# EAGLE schematic alan2 (EAGLE 7.4.0)
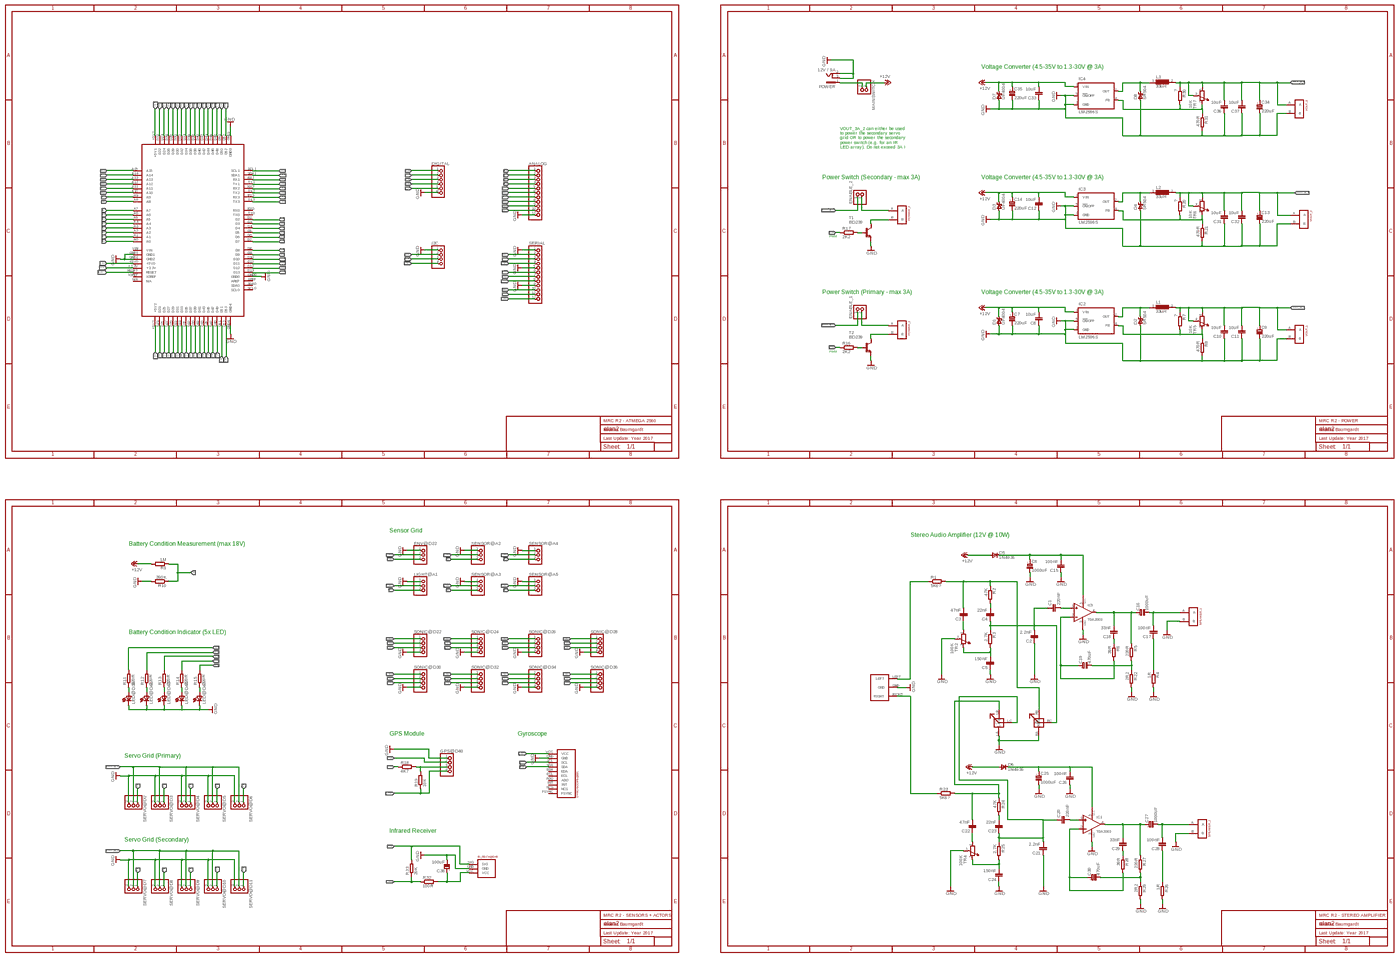
[diagram p0: schematic, sheet 1, overview]
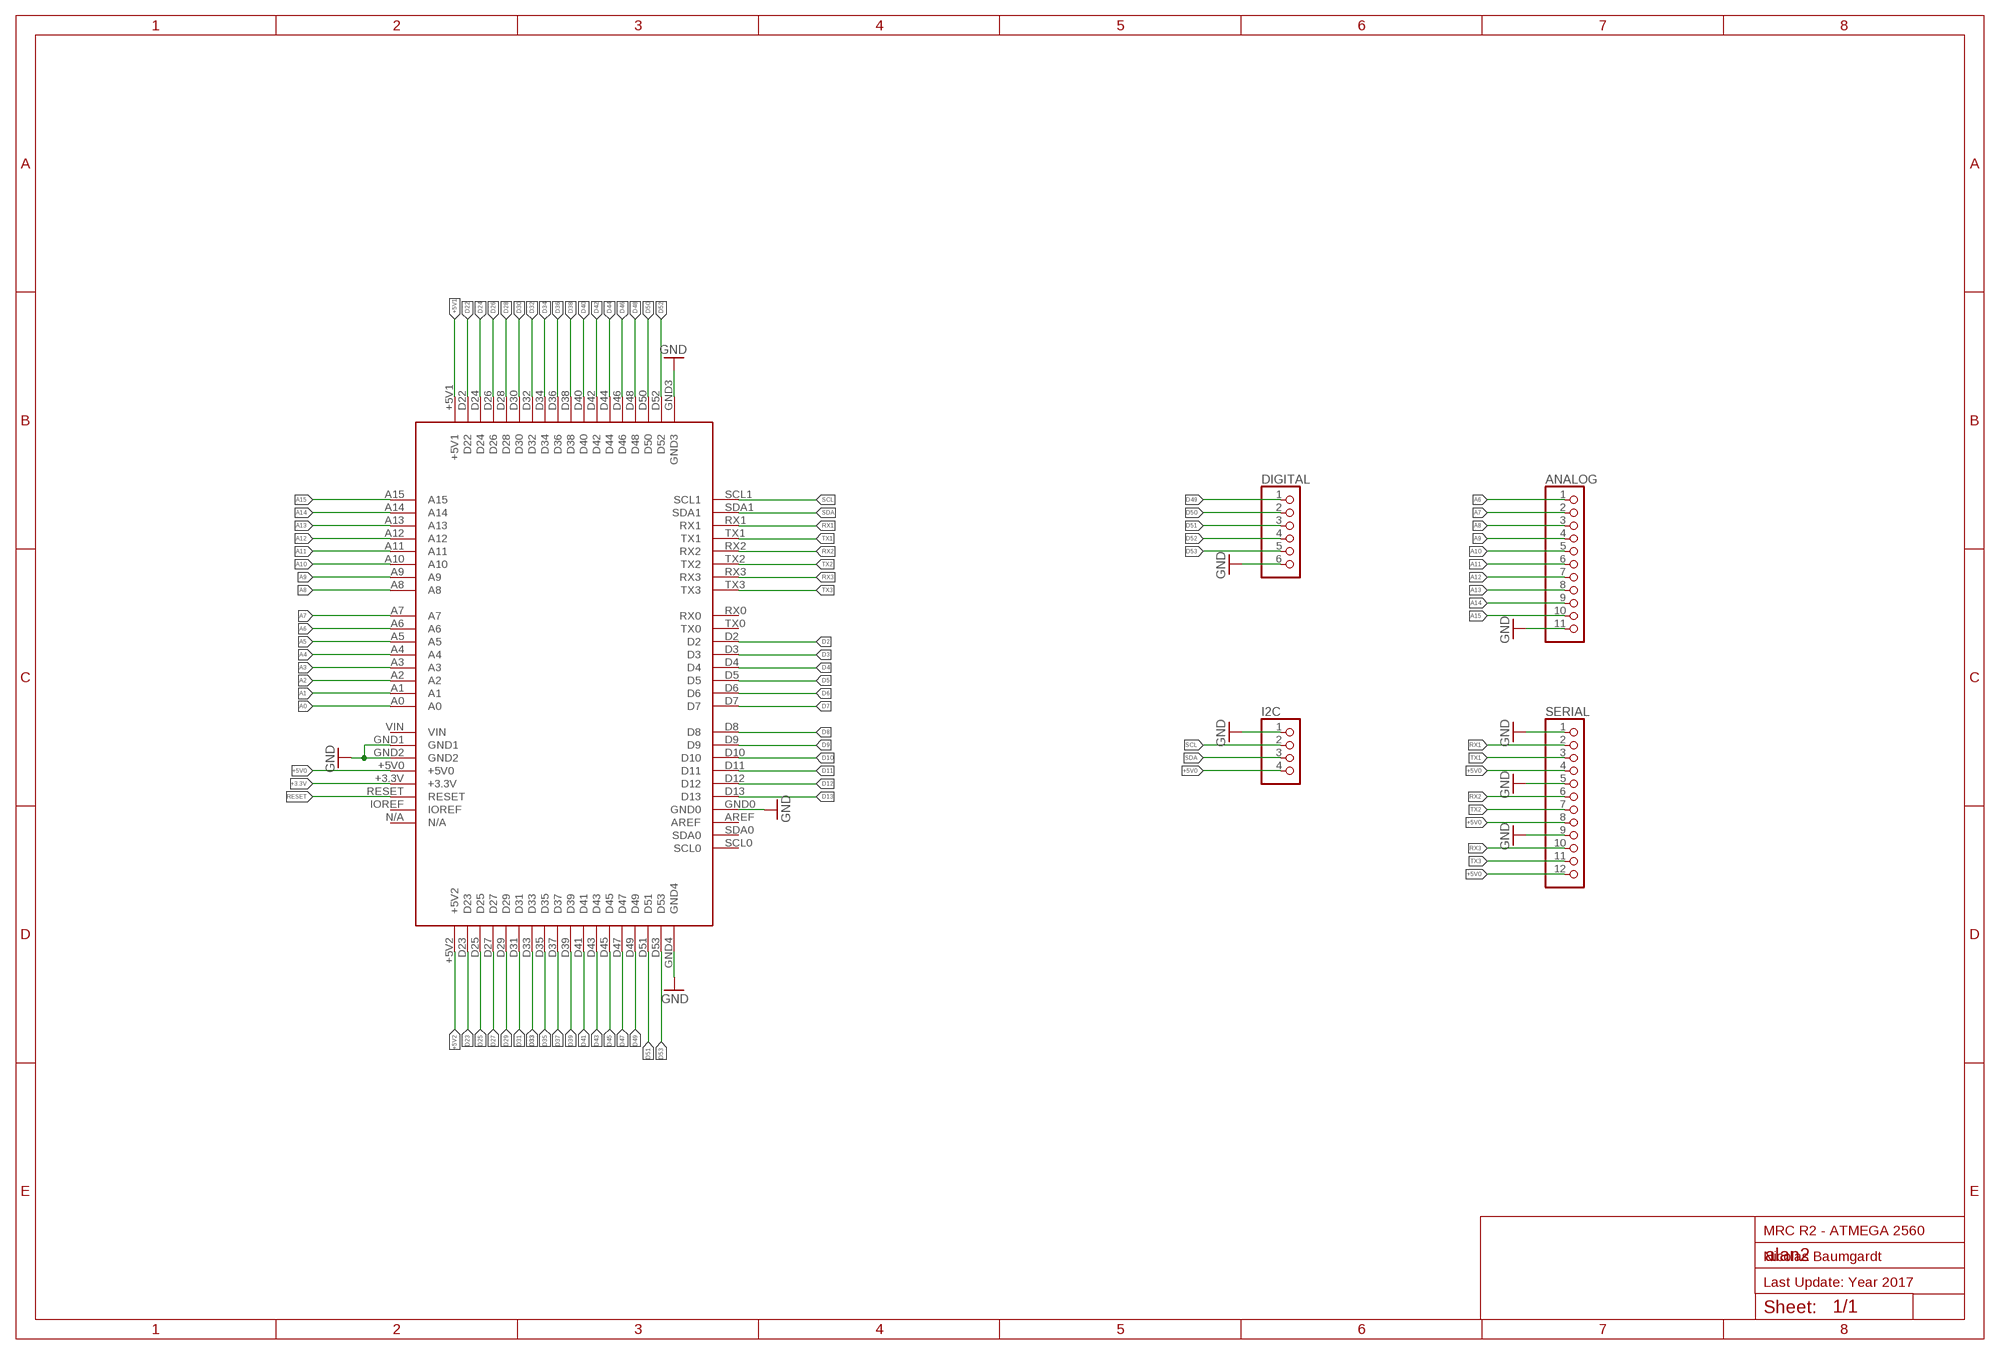
[diagram p1: schematic, sheet 1, part 1 of 4]
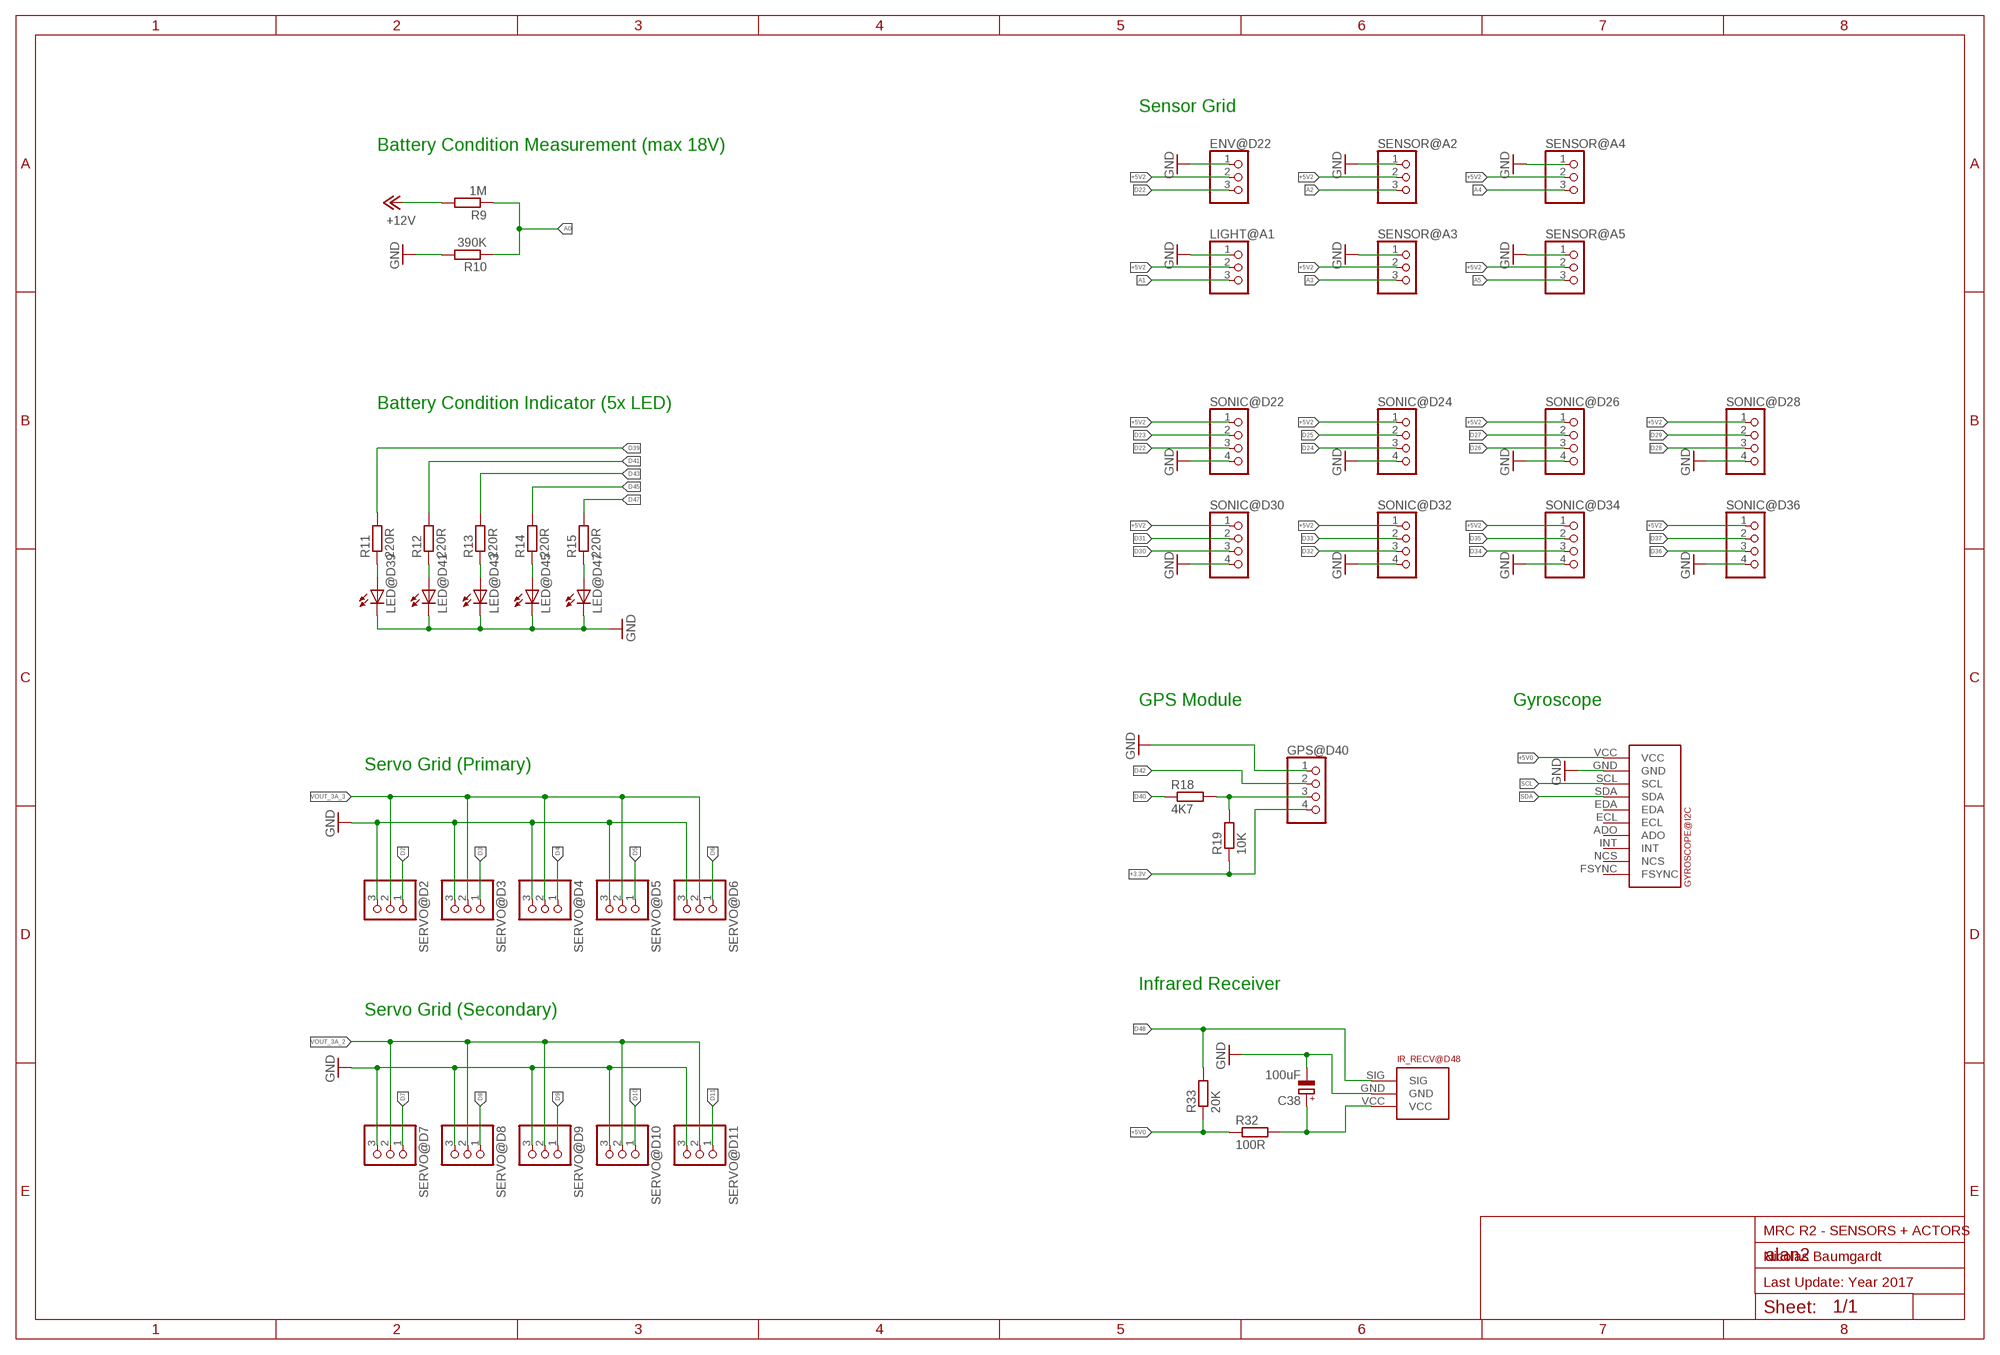
[diagram p2: schematic, sheet 1, part 2 of 4]
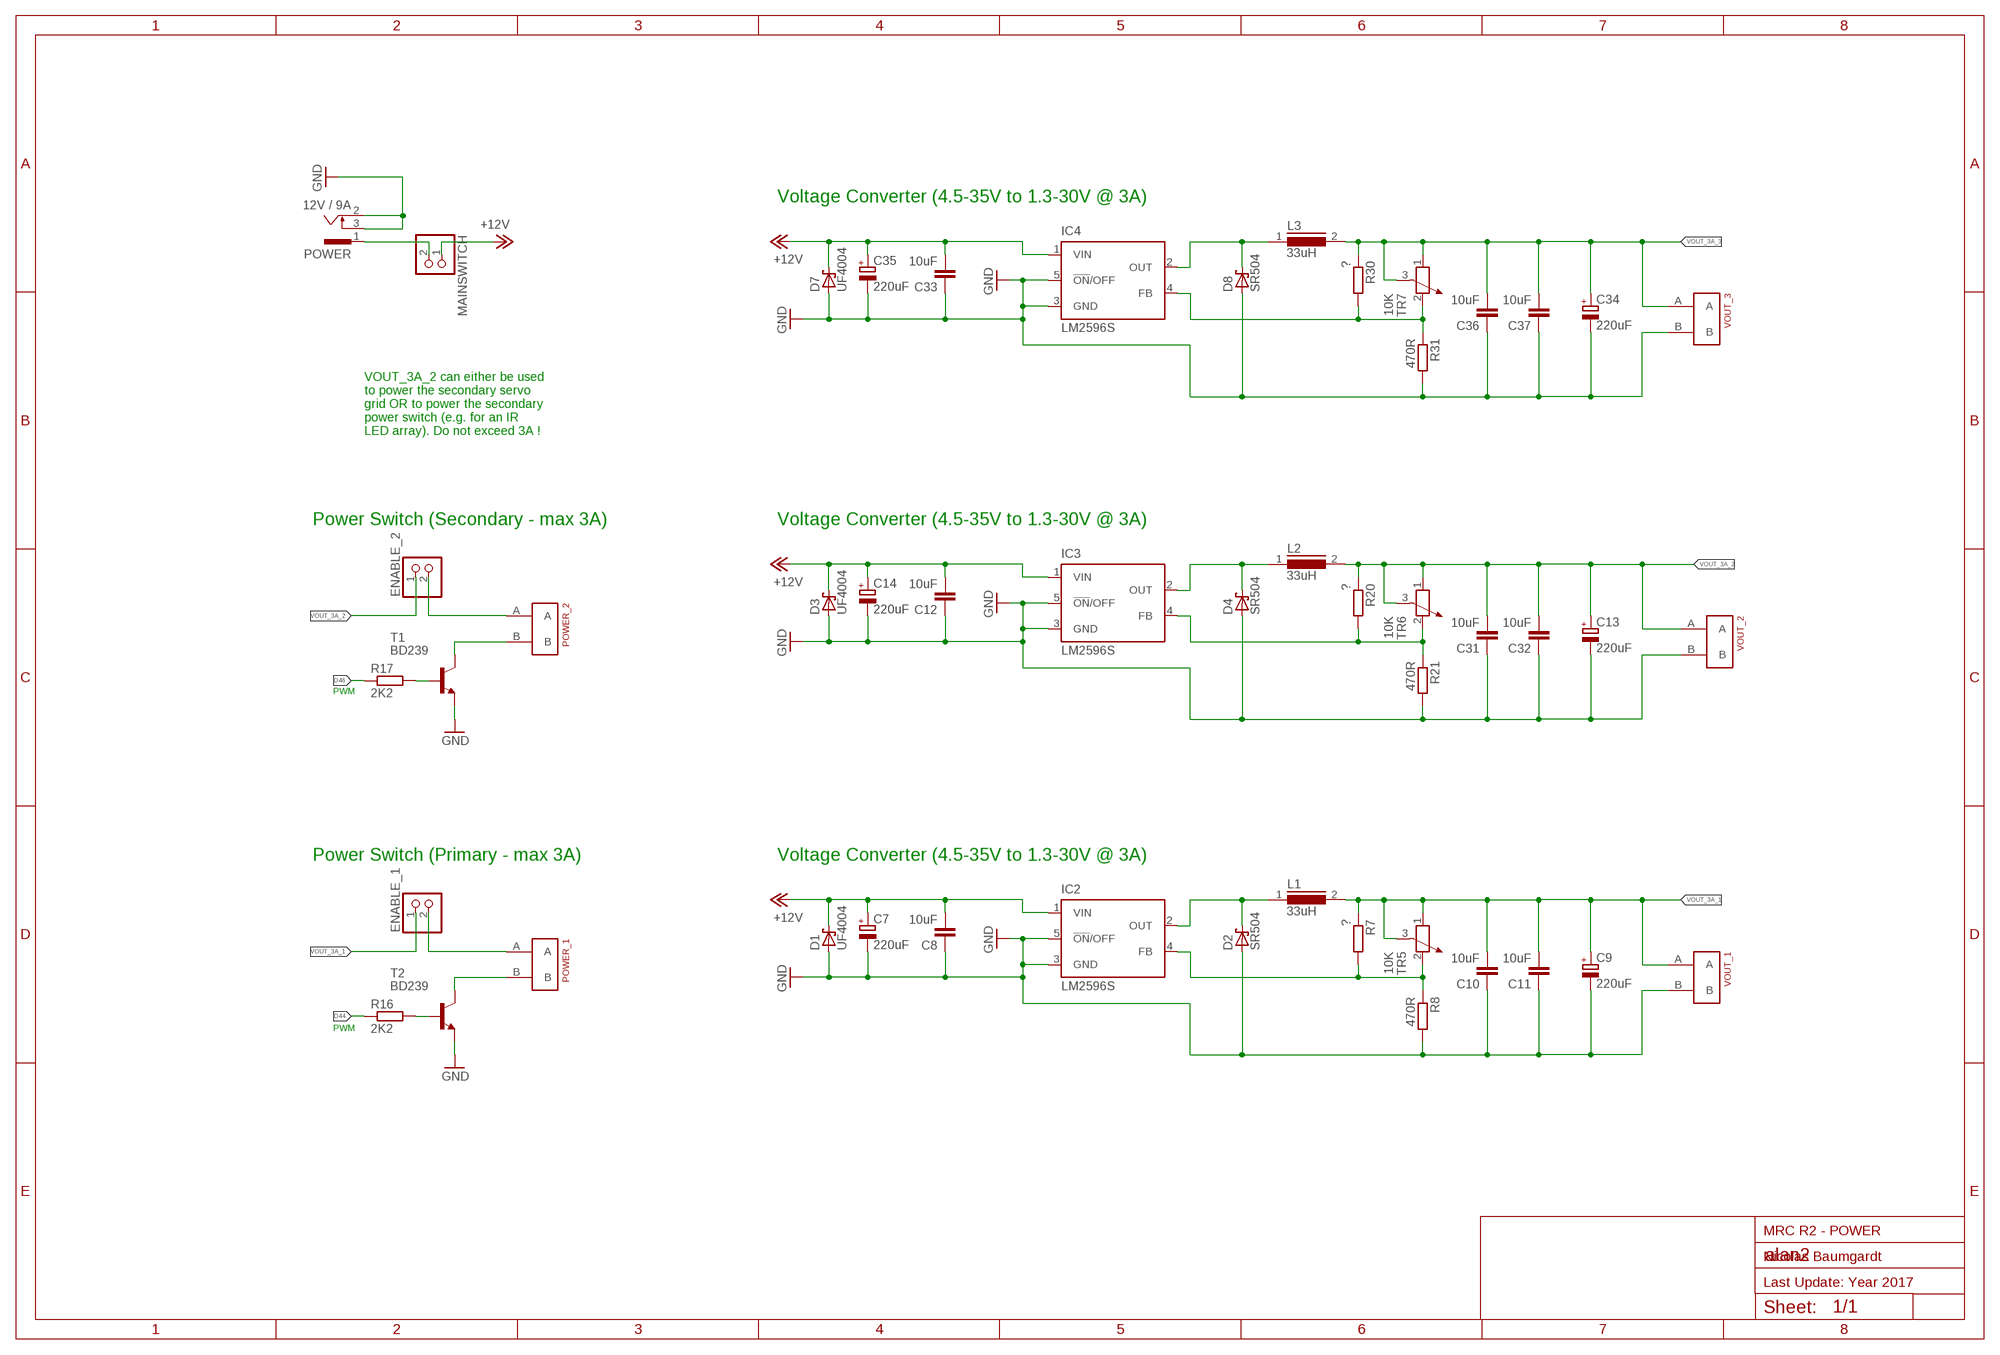
[diagram p3: schematic, sheet 1, part 3 of 4]
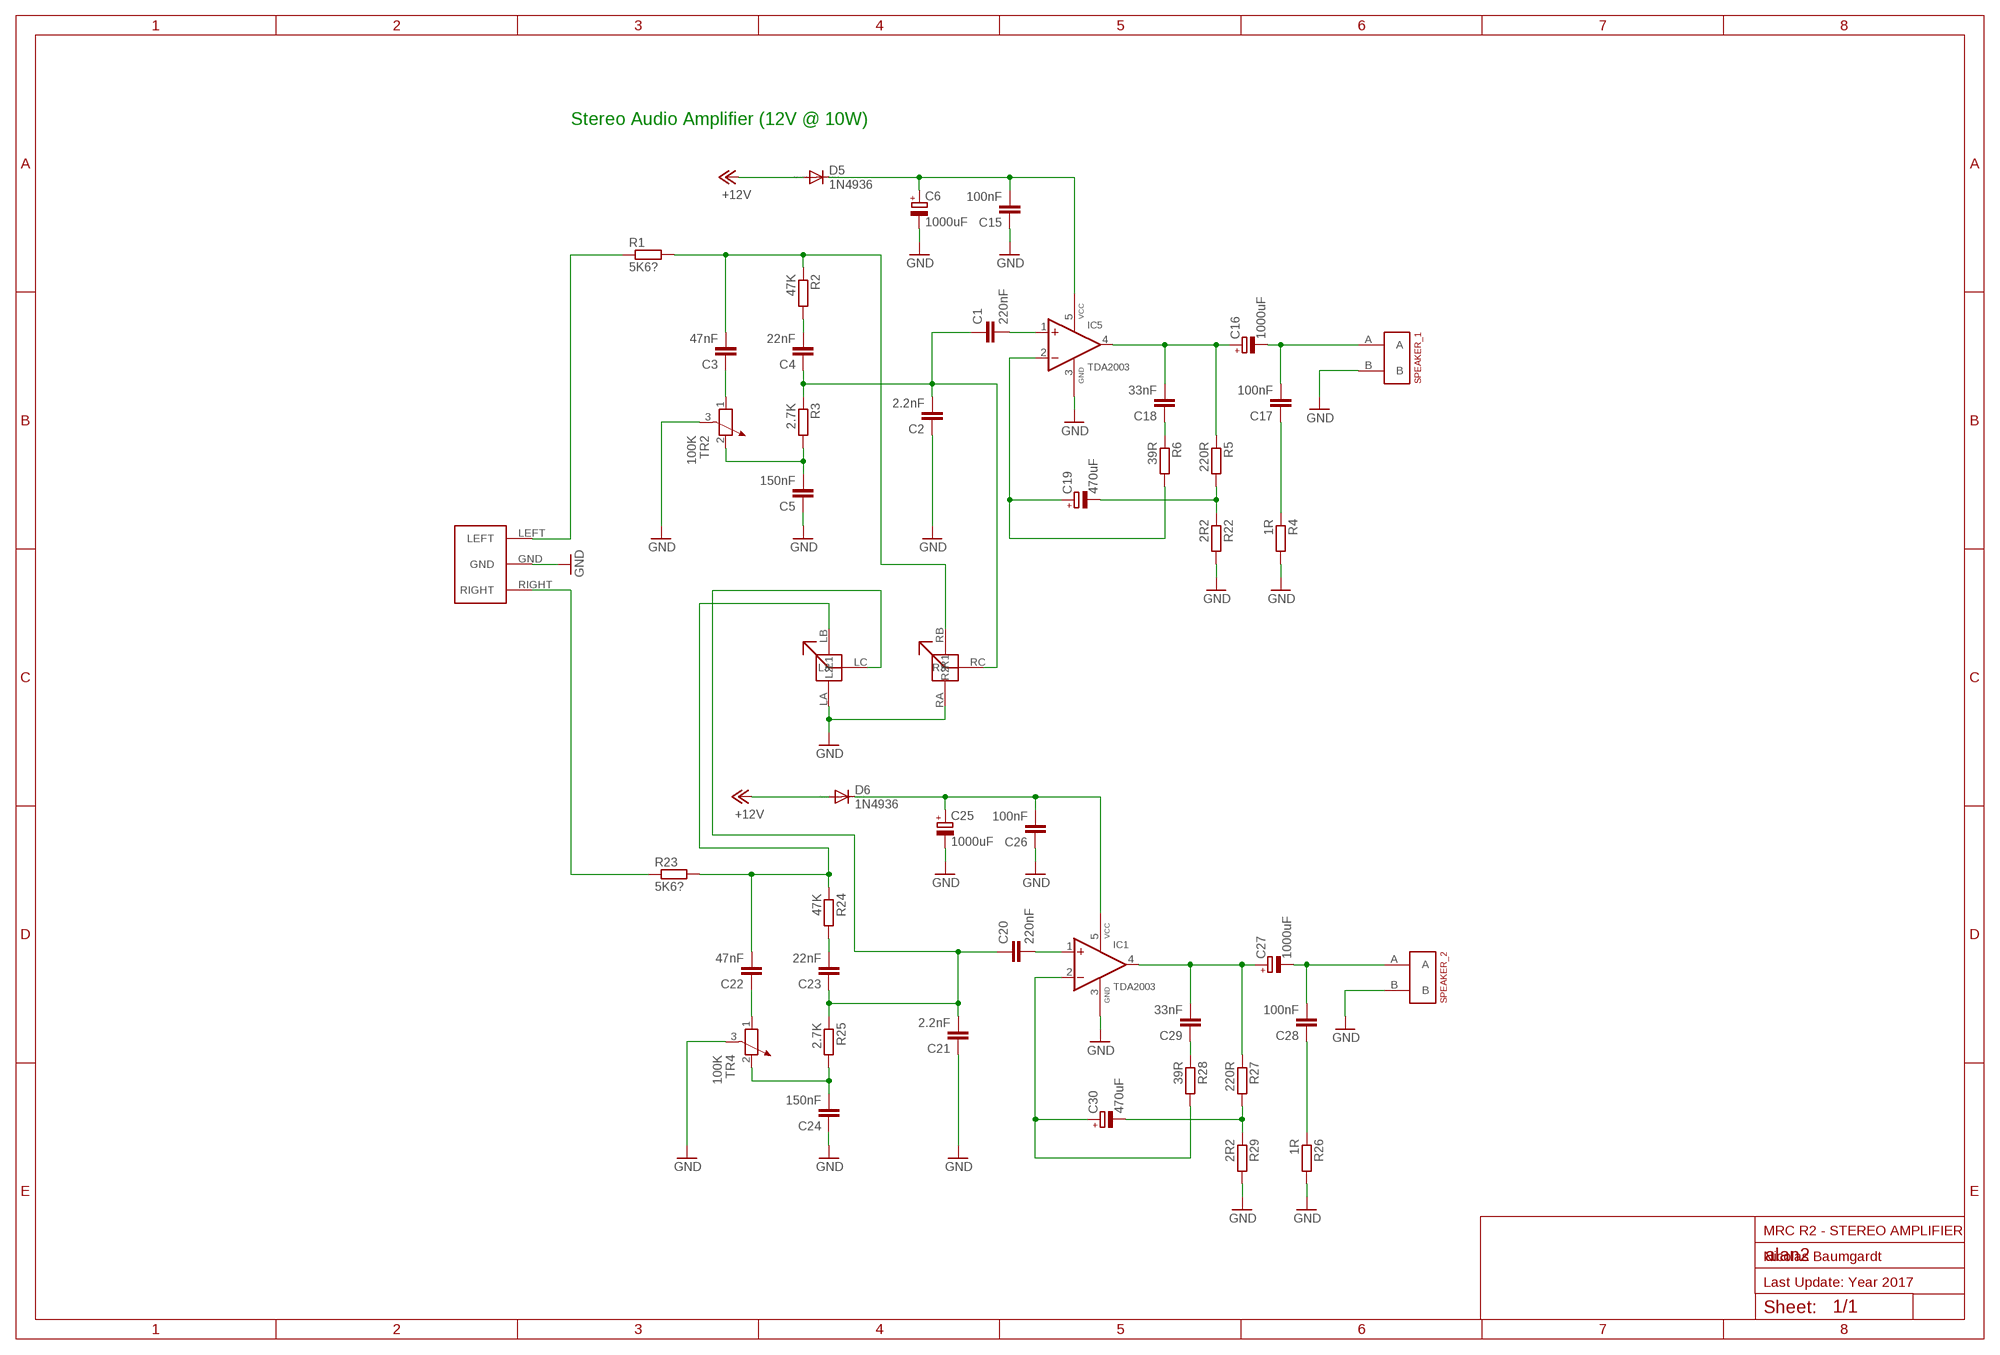
[diagram p4: schematic, sheet 1, part 4 of 4]

## Parts
ANALOG  PINHD-1X11  [1X11]
ATMEGA  ARDUINO_MEGA_PINOUT  [ARDUINO_MEGA_PINOUT]
AUDIO_IN  AUDIOJACK  [AUDIOJACK]
C1  220nF  C-EU050-035X075  [C050-035X075]
C2  2.2nF  C-EU050-035X075  [C050-035X075]
C3  47nF  C-EU050-035X075  [C050-035X075]
C4  22nF  C-EU050-035X075  [C050-035X075]
C5  150nF  C-EU050-035X075  [C050-035X075]
C6  1000uF  CPOL-EUE5-13  [E5-13]
C7  220uF  CPOL-EUE5-8.5  [E5-8,5]
C8  10uF  C-EU050-035X075  [C050-035X075]
C9  220uF  CPOL-EUE5-8.5  [E5-8,5]
C10  10uF  C-EU050-035X075  [C050-035X075]
C11  10uF  C-EU050-035X075  [C050-035X075]
C12  10uF  C-EU050-035X075  [C050-035X075]
C13  220uF  CPOL-EUE5-8.5  [E5-8,5]
C14  220uF  CPOL-EUE5-8.5  [E5-8,5]
C15  100nF  C-EU050-035X075  [C050-035X075]
C16  1000uF  CPOL-EUE5-13  [E5-13]
C17  100nF  C-EU050-035X075  [C050-035X075]
C18  33nF  C-EU050-035X075  [C050-035X075]
C19  470uF  CPOL-EUE5-10.5  [E5-10,5]
C20  220nF  C-EU050-035X075  [C050-035X075]
C21  2.2nF  C-EU050-035X075  [C050-035X075]
C22  47nF  C-EU050-035X075  [C050-035X075]
C23  22nF  C-EU050-035X075  [C050-035X075]
C24  150nF  C-EU050-035X075  [C050-035X075]
C25  1000uF  CPOL-EUE5-13  [E5-13]
C26  100nF  C-EU050-035X075  [C050-035X075]
C27  1000uF  CPOL-EUE5-13  [E5-13]
C28  100nF  C-EU050-035X075  [C050-035X075]
C29  33nF  C-EU050-035X075  [C050-035X075]
C30  470uF  CPOL-EUE5-10.5  [E5-10,5]
C31  10uF  C-EU050-035X075  [C050-035X075]
C32  10uF  C-EU050-035X075  [C050-035X075]
C33  10uF  C-EU050-035X075  [C050-035X075]
C34  220uF  CPOL-EUE5-8.5  [E5-8,5]
C35  220uF  CPOL-EUE5-8.5  [E5-8,5]
C36  10uF  C-EU050-035X075  [C050-035X075]
C37  10uF  C-EU050-035X075  [C050-035X075]
C38  100uF  CPOL-EUE2.5-5  [E2,5-5]
D1  UF4004  1N5817-T  [DO41-7.6]
D2  SR504  1N5817-T  [DO41-7.6]
D3  UF4004  1N5817-T  [DO41-7.6]
D4  SR504  1N5817-T  [DO41-7.6]
D5  1N4936  1N4004  [DO41-10]
D6  1N4936  1N4004  [DO41-10]
D7  UF4004  1N5817-T  [DO41-7.6]
D8  SR504  1N5817-T  [DO41-7.6]
DIGITAL  PINHD-1X6  [1X06]
ENABLE_1  PINHD-1X2  [1X02]
ENABLE_2  PINHD-1X2  [1X02]
ENV@D22  PINHD-1X3  [1X03]
GPS@D40  PINHD-1X4  [1X04]
GYROSCOPE@I2C  GYROSCOPE  [GYROSCOPE]
I2C  PINHD-1X4  [1X04]
IC1  TDA2003  [PENTAWATT-V]
IC2  LM2596S  [TO263-5]
IC3  LM2596S  [TO263-5]
IC4  LM2596S  [TO263-5]
IC5  TDA2003  [PENTAWATT-V]
IR_RECV@D48  TSOP1838  [TSOP1838]
L1  33uH  SFT830D  [SFT830D]
L2  33uH  SFT830D  [SFT830D]
L3  33uH  SFT830D  [SFT830D]
LED@D39  LED5MM  [LED5MM]
LED@D41  LED5MM  [LED5MM]
LED@D43  LED5MM  [LED5MM]
LED@D45  LED5MM  [LED5MM]
LED@D47  LED5MM  [LED5MM]
LIGHT@A1  PINHD-1X3  [1X03]
MAINSWITCH  PINHD-1X2  [1X02]
POWER  12V / 9A  SCD-014A  [SCD-014-A]
POWER_1  TERMINAL_BLOCK  [TERMINAL_BLOCK]
POWER_2  TERMINAL_BLOCK  [TERMINAL_BLOCK]
R1  5K6?  R-EU_0204/7  [0204/7]
R2  47K  R-EU_0204/7  [0204/7]
R3  2.7K  R-EU_0204/7  [0204/7]
R4  1R  R-EU_0204/7  [0204/7]
R5  220R  R-EU_0204/7  [0204/7]
R6  39R  R-EU_0204/7  [0204/7]
R7  ?  R-EU_0204/7  [0204/7]
R8  470R  R-EU_0204/7  [0204/7]
R9  1M  R-EU_0207/7  [0207/7]
R10  390K  R-EU_0207/7  [0207/7]
R11  220R  R-EU_0204/7  [0204/7]
R12  220R  R-EU_0204/7  [0204/7]
R13  220R  R-EU_0204/7  [0204/7]
R14  220R  R-EU_0204/7  [0204/7]
R15  220R  R-EU_0204/7  [0204/7]
R16  2K2  R-EU_0207/7  [0207/7]
R17  2K2  R-EU_0207/7  [0207/7]
R18  4K7  R-EU_0204/7  [0204/7]
R19  10K  R-EU_0204/7  [0204/7]
R20  ?  R-EU_0204/7  [0204/7]
R21  470R  R-EU_0204/7  [0204/7]
R22  2R2  R-EU_0204/7  [0204/7]
R23  5K6?  R-EU_0204/7  [0204/7]
R24  47K  R-EU_0204/7  [0204/7]
R25  2.7K  R-EU_0204/7  [0204/7]
R26  1R  R-EU_0204/7  [0204/7]
R27  220R  R-EU_0204/7  [0204/7]
R28  39R  R-EU_0204/7  [0204/7]
R29  2R2  R-EU_0204/7  [0204/7]
R30  ?  R-EU_0204/7  [0204/7]
R31  470R  R-EU_0204/7  [0204/7]
R32  100R  R-EU_0204/7  [0204/7]
R33  20K  R-EU_0204/7  [0204/7]
SENSOR@A2  PINHD-1X3  [1X03]
SENSOR@A3  PINHD-1X3  [1X03]
SENSOR@A4  PINHD-1X3  [1X03]
SENSOR@A5  PINHD-1X3  [1X03]
SERIAL  PINHD-1X12  [1X12]
SERVO@D2  PINHD-1X3  [1X03]
SERVO@D3  PINHD-1X3  [1X03]
SERVO@D4  PINHD-1X3  [1X03]
SERVO@D5  PINHD-1X3  [1X03]
SERVO@D6  PINHD-1X3  [1X03]
SERVO@D7  PINHD-1X3  [1X03]
SERVO@D8  PINHD-1X3  [1X03]
SERVO@D9  PINHD-1X3  [1X03]
SERVO@D10  PINHD-1X3  [1X03]
SERVO@D11  PINHD-1X3  [1X03]
SONIC@D22  PINHD-1X4  [1X04]
SONIC@D24  PINHD-1X4  [1X04]
SONIC@D26  PINHD-1X4  [1X04]
SONIC@D28  PINHD-1X4  [1X04]
SONIC@D30  PINHD-1X4  [1X04]
SONIC@D32  PINHD-1X4  [1X04]
SONIC@D34  PINHD-1X4  [1X04]
SONIC@D36  PINHD-1X4  [1X04]
SPEAKER_1  TERMINAL_BLOCK  [TERMINAL_BLOCK]
SPEAKER_2  TERMINAL_BLOCK  [TERMINAL_BLOCK]
T1  BD239  [TO220]
T2  BD239  [TO220]
TR2  100K  POTENTIOMETER_PT-10  [PT-10]
TR4  100K  POTENTIOMETER_PT-10  [PT-10]
TR5  10K  POTENTIOMETER_PT-10  [PT-10]
TR6  10K  POTENTIOMETER_PT-10  [PT-10]
TR7  10K  POTENTIOMETER_PT-10  [PT-10]
U$2  POTI_STEREO  [POTI_STEREO]
VOUT_1  TERMINAL_BLOCK  [TERMINAL_BLOCK]
VOUT_2  TERMINAL_BLOCK  [TERMINAL_BLOCK]
VOUT_3  TERMINAL_BLOCK  [TERMINAL_BLOCK]

## Nets
+3.3V [lo_power]: ATMEGA.+3.3V GPS@D40.4 R19.1
+5V0 [lo_power]: ATMEGA.+5V0 GYROSCOPE@I2C.VCC I2C.4 R32.1 R33.1 SERIAL.4 SERIAL.8 SERIAL.12
+5V1 [lo_power]: ATMEGA.+5V1
+5V2 [lo_power]: ATMEGA.+5V2 ENV@D22.2 LIGHT@A1.2 SENSOR@A2.2 SENSOR@A3.2 SENSOR@A4.2 SENSOR@A5.2 SONIC@D22.1 SONIC@D24.1 SONIC@D26.1 SONIC@D28.1 SONIC@D30.1 SONIC@D32.1 SONIC@D34.1 SONIC@D36.1
+12V [hi_pow]: C7.+ C8.2 C12.2 C14.+ C33.2 C35.+ D1.C D3.C D5.A D6.A D7.C IC2.1(VIN) IC3.1(VIN) IC4.1(VIN) MAINSWITCH.1 R9.2
A0: ATMEGA.A0 R9.1 R10.1
A1: ATMEGA.A1 LIGHT@A1.3
A2: ATMEGA.A2 SENSOR@A2.3
A3: ATMEGA.A3 SENSOR@A3.3
A4: ATMEGA.A4 SENSOR@A4.3
A5: ATMEGA.A5 SENSOR@A5.3
A6: ANALOG.1 ATMEGA.A6
A7: ANALOG.2 ATMEGA.A7
A8: ANALOG.3 ATMEGA.A8
A9: ANALOG.4 ATMEGA.A9
A10: ANALOG.5 ATMEGA.A10
A11: ANALOG.6 ATMEGA.A11
A12: ANALOG.7 ATMEGA.A12
A13: ANALOG.8 ATMEGA.A13
A14: ANALOG.9 ATMEGA.A14
A15: ANALOG.10 ATMEGA.A15
D2: ATMEGA.D2 SERVO@D2.1
D3: ATMEGA.D3 SERVO@D3.1
D4: ATMEGA.D4 SERVO@D4.1
D5: ATMEGA.D5 SERVO@D5.1
D6: ATMEGA.D6 SERVO@D6.1
D7: ATMEGA.D7 SERVO@D7.1
D8: ATMEGA.D8 SERVO@D8.1
D9: ATMEGA.D9 SERVO@D9.1
D10: ATMEGA.D10 SERVO@D10.1
D11: ATMEGA.D11 SERVO@D11.1
D12: ATMEGA.D12
D13: ATMEGA.D13
D22: ATMEGA.D22 ENV@D22.3 SONIC@D22.3
D23: ATMEGA.D23 SONIC@D22.2
D24: ATMEGA.D24 SONIC@D24.3
D25: ATMEGA.D25 SONIC@D24.2
D26: ATMEGA.D26 SONIC@D26.3
D27: ATMEGA.D27 SONIC@D26.2
D28: ATMEGA.D28 SONIC@D28.3
D29: ATMEGA.D29 SONIC@D28.2
D30: ATMEGA.D30 SONIC@D30.3
D31: ATMEGA.D31 SONIC@D30.2
D32: ATMEGA.D32 SONIC@D32.3
D33: ATMEGA.D33 SONIC@D32.2
D34: ATMEGA.D34 SONIC@D34.3
D35: ATMEGA.D35 SONIC@D34.2
D36: ATMEGA.D36 SONIC@D36.3
D37: ATMEGA.D37 SONIC@D36.2
D38: ATMEGA.D38
D39: ATMEGA.D39 R11.2
D40: ATMEGA.D40 R18.1
D41: ATMEGA.D41 R12.2
D42: ATMEGA.D42 GPS@D40.2
D43: ATMEGA.D43 R13.2
D44: ATMEGA.D44 R16.1
D45: ATMEGA.D45 R14.2
D46: ATMEGA.D46 R17.1
D47: ATMEGA.D47 R15.2
D48: ATMEGA.D48 IR_RECV@D48.SIG R33.2
D49: ATMEGA.D49 DIGITAL.1
D50: ATMEGA.D50 DIGITAL.2
D51: ATMEGA.D51 DIGITAL.3
D52: ATMEGA.D52 DIGITAL.4
D53: ATMEGA.D53 DIGITAL.5
GND: ANALOG.11 ATMEGA.GND0 ATMEGA.GND1 ATMEGA.GND2 ATMEGA.GND3 ATMEGA.GND4 AUDIO_IN.GND C2.1 C5.1 C6.- C7.- C8.1 C9.- C10.1 C11.1 C12.1 C13.- C14.- C15.1 C21.1 C24.1 C25.- C26.1 C31.1 C32.1 C33.1 C34.- C35.- C36.1 C37.1 C38.- D1.A D2.A D3.A D4.A D7.A D8.A DIGITAL.6 ENV@D22.1 GPS@D40.1 GYROSCOPE@I2C.GND I2C.1 IC1.3(GND) IC2.3(GND) IC2.5(!ON!/OFF) IC3.3(GND) IC3.5(!ON!/OFF) IC4.3(GND) IC4.5(!ON!/OFF) IC5.3(GND) IR_RECV@D48.GND LED@D39.K(C) LED@D41.K(C) LED@D43.K(C) LED@D45.K(C) LED@D47.K(C) LIGHT@A1.1 POWER.2 POWER.3 R4.2 R8.2 R10.2 R21.2 R22.2 R26.2 R29.2 R31.2 SENSOR@A2.1 SENSOR@A3.1 SENSOR@A4.1 SENSOR@A5.1 SERIAL.1 SERIAL.5 SERIAL.9 SERVO@D2.3 SERVO@D3.3 SERVO@D4.3 SERVO@D5.3 SERVO@D6.3 SERVO@D7.3 SERVO@D8.3 SERVO@D9.3 SERVO@D10.3 SERVO@D11.3 SONIC@D22.4 SONIC@D24.4 SONIC@D26.4 SONIC@D28.4 SONIC@D30.4 SONIC@D32.4 SONIC@D34.4 SONIC@D36.4 SPEAKER_1.B SPEAKER_2.B T1.3(E) T2.3(E) TR2.3 TR4.3 U$2.LA(L1) U$2.RA(R1) VOUT_1.B VOUT_2.B VOUT_3.B
N$1 [hi_pow]: MAINSWITCH.2 POWER.1
N$2: C3.2 R1.2 R2.1 U$2.RB(R2)
N$3 [hi_pow]: C6.+ C15.2 D5.C IC5.5(VCC)
N$4: C1.2 IC5.1(+IN)
N$5: C3.1 TR2.1
N$6: C4.2 R2.2
N$7: C1.1 C2.2 C4.1 R3.1 U$2.RC(R3)
N$8: C5.2 R3.2 TR2.2
N$9 [lo_power]: C16.+ C18.2 IC5.4(OUT) R5.1
N$10 [lo_power]: C16.- C17.2 SPEAKER_1.A
N$11 [lo_power]: C17.1 R4.1
N$12 [lo_power]: C19.- R5.2 R22.1
N$13: C18.1 R6.1
N$14 [hi_pow]: ENABLE_1.2 POWER_1.A
N$15 [lo_power]: C19.+ IC5.2(-IN) R6.2
N$16: AUDIO_IN.LEFT R1.1
N$17 [hi_pow]: D4.C IC3.2(OUT) L2.1
N$18 [hi_pow]: IC2.4(FB) R7.2 R8.1 TR5.2
N$19 [hi_pow]: D2.C IC2.2(OUT) L1.1
N$20: R17.2 T1.1(B)
N$21 [hi_pow]: IC3.4(FB) R20.2 R21.1 TR6.2
N$22 [hi_pow]: ENABLE_2.2 POWER_2.A
N$23: C22.2 R23.2 R24.1 U$2.LB(L2)
N$24 [hi_pow]: D8.C IC4.2(OUT) L3.1
N$25 [hi_pow]: POWER_2.B T1.2(C)
N$26: GPS@D40.3 R18.2 R19.2
N$27: AUDIO_IN.RIGHT R23.1
N$28: C38.+ IR_RECV@D48.VCC R32.2
N$30: LED@D47.A R15.1
N$31: LED@D45.A R14.1
N$32: LED@D43.A R13.1
N$33: LED@D41.A R12.1
N$34: LED@D39.A R11.1
N$37: R16.2 T2.1(B)
N$43 [hi_pow]: IC4.4(FB) R30.2 R31.1 TR7.2
N$47: C20.2 IC1.1(+IN)
N$48: C22.1 TR4.1
N$49: C23.2 R24.2
N$50: C20.1 C21.2 C23.1 R25.1 U$2.LC(L3)
N$51: C24.2 R25.2 TR4.2
N$52 [hi_pow]: C25.+ C26.2 D6.C IC1.5(VCC)
N$54 [lo_power]: C27.+ C29.2 IC1.4(OUT) R27.1
N$55 [lo_power]: C27.- C28.2 SPEAKER_2.A
N$56 [lo_power]: C28.1 R26.1
N$99 [hi_pow]: POWER_1.B T2.2(C)
N$100 [lo_power]: C30.- R27.2 R29.1
N$101: C29.1 R28.1
N$102 [lo_power]: C30.+ IC1.2(-IN) R28.2
RESET: ATMEGA.RESET
RX1: ATMEGA.RX1 SERIAL.2
RX2: ATMEGA.RX2 SERIAL.6
RX3: ATMEGA.RX3 SERIAL.10
SCL: ATMEGA.SCL1 GYROSCOPE@I2C.SCL I2C.2
SDA: ATMEGA.SDA1 GYROSCOPE@I2C.SDA I2C.3
TX1: ATMEGA.TX1 SERIAL.3
TX2: ATMEGA.TX2 SERIAL.7
TX3: ATMEGA.TX3 SERIAL.11
VOUT_3A_1 [hi_pow]: C9.+ C10.2 C11.2 ENABLE_1.1 L1.2 R7.1 TR5.1 TR5.3 VOUT_1.A
VOUT_3A_2 [hi_pow]: C13.+ C31.2 C32.2 ENABLE_2.1 L2.2 R20.1 SERVO@D7.2 SERVO@D8.2 SERVO@D9.2 SERVO@D10.2 SERVO@D11.2 TR6.1 TR6.3 VOUT_2.A
VOUT_3A_3 [hi_pow]: C34.+ C36.2 C37.2 L3.2 R30.1 SERVO@D2.2 SERVO@D3.2 SERVO@D4.2 SERVO@D5.2 SERVO@D6.2 TR7.1 TR7.3 VOUT_3.A
Unconnected: ATMEGA.AREF ATMEGA.IOREF ATMEGA.N/A ATMEGA.RX0 ATMEGA.SCL0 ATMEGA.SDA0 ATMEGA.TX0 ATMEGA.VIN GYROSCOPE@I2C.ADO GYROSCOPE@I2C.ECL GYROSCOPE@I2C.EDA GYROSCOPE@I2C.FSYNC GYROSCOPE@I2C.INT GYROSCOPE@I2C.NCS

## Notes on the sheet
- Voltage Converter (4.5-35V to 1.3-30V @ 3A)
- VOUT_3A_2 can either be used
  to power the secondary servo
  grid OR to power the secondary
  power switch (e.g. for an IR
  LED array). Do not exceed 3A !
- Power Switch (Secondary - max 3A) | Voltage Converter (4.5-35V to 1.3-30V @ 3A)
- PWM
- Power Switch (Primary - max 3A) | Voltage Converter (4.5-35V to 1.3-30V @ 3A)
- PWM
- MRC R2 - ATMEGA 2560 | MRC R2 - POWER
- Nicolas Baumgardt | Nicolas Baumgardt
- Last Update: Year 2017 | Last Update: Year 2017
- Sensor Grid
- Stereo Audio Amplifier (12V @ 10W)
- Battery Condition Measurement (max 18V)
- Battery Condition Indicator (5x LED)
- GPS Module | Gyroscope
- Servo Grid (Primary)
- Infrared Receiver
- Servo Grid (Secondary)
- MRC R2 - SENSORS + ACTORS | MRC R2 - STEREO AMPLIFIER
- Nicolas Baumgardt | Nicolas Baumgardt
- Last Update: Year 2017 | Last Update: Year 2017

## Library data of the parts
ANALOG = pinhead:PINHD-1X11: PIN HEADER
ATMEGA = arduino_mega_pinout:ARDUINO_MEGA_PINOUT: ARDUINO_MEGA_PINOUT
AUDIO_IN = audio_jack:AUDIOJACK: Audio Jack
C1-C5 C8 C10-C12 C15 C17 C18 C20-C24 C26 C28 C29 C31-C33 C36 C37 = rcl:C-EU: CAPACITOR, European symbol
C6 C7 C9 C13 C14 C16 C19 C25 C27 C30 C34 C35 C38 = rcl:CPOL-EU: POLARIZED CAPACITOR, European symbol
D1-D4 D7 D8 = diode:1N581*: 1.0A SCHOTTKY BARRIER RECTIFIER Source: http://www.diodes.com/datasheets/ds23001.pdf
D5 D6 = diode:1N4004: DIODE general purpose rectifier, 1 A
DIGITAL = pinhead:PINHD-1X6: PIN HEADER
ENABLE_1 ENABLE_2 MAINSWITCH = pinhead:PINHD-1X2: PIN HEADER
ENV@D22 LIGHT@A1 SENSOR@A2-SENSOR@A5 SERVO@D2-SERVO@D11 = pinhead:PINHD-1X3: PIN HEADER
GPS@D40 I2C SONIC@D22 SONIC@D24 SONIC@D26 SONIC@D28 SONIC@D30 SONIC@D32 SONIC@D34 SONIC@D36 = pinhead:PINHD-1X4: PIN HEADER
GYROSCOPE@I2C = gyroscope:GYROSCOPE: Gyroscope
IC1 IC5 = tda2003:TDA2003: Car Radio Audio Amplifier
IC2-IC4 = national-semiconductor:LM2596: SIMPLE SWITCHER® Power Converter 150 kHz 3A Step-Down Voltage Regulator Source: http://www.national.com/ds/LM/LM2596.pdf; MF: NATIONAL SEMICONDUCTOR; MPN: LM2596S-ADJ/NOPB; OC_FARNELL: 9494367; OC_NEWARK: 41K3842
IR_RECV@D48 = TSOP1840:TSOP1838: IR Receiver (TSOP1840)
L1-L3 = inductors:SFT830D: INDUCTOR
LED@D39 LED@D41 LED@D43 LED@D45 LED@D47 = led:LED: LED OSRAM: - CHIPLED LG R971, LG N971, LY N971, LG Q971, LY Q971, LO R971, LY R971 LH N974, LH R974 LS Q976, LO Q976, LY Q976 LO Q996 - Hyper CHIPLED LW Q18S LB Q993, LB Q99A, LB R99A - SideLED LS A670, LO A670, LY A670, LG A670, LP A670 LB A673, LV A673, LT A673, LW A673 LH A674 LY A675 LS A676, LA A676, LO A676, LY A676, LW A676 LS A679, LY A679, LG A679 - Hyper Micro SIDELED® LS Y876, LA Y876, LO Y876, LY Y876 LT Y87S - SmartLED LW L88C, LW L88S LB L89C, LB L89S, LG L890 LS L89K, LO L89K, LY L89K LS L896, LA L896, LO L896, LY L896 - TOPLED LS T670, LO T670, LY T670, LG T670, LP T670 LSG T670, LSP T670, LSY T670, LOP T670, LYG T670 LG T671, LOG T671, LSG T671 LB T673, LV T673, LT T673, LW T673 LH T674 LS T676, LA T676, LO T676, LY T676, LB T676, LH T676, LSB T676, LW T676 LB T67C, LV T67C, LT T67C, LS T67K, LO T67K, LY T67K, LW E67C LS E67B, LA E67B, LO E67B, LY E67B, LB E67C, LV E67C, LT E67C LW T67C LS T679, LY T679, LG T679 LS T770, LO T770, LY T770, LG T770, LP T770 LB T773, LV T773, LT T773, LW T773 LH T774 LS E675, LA E675, LY E675, LS T675 LS T776, LA T776, LO T776, LY T776, LB T776 LHGB T686 LT T68C, LB T68C - Hyper Mini TOPLED® LB M676 - Mini TOPLED Santana® LG M470 LS M47K, LO M47K, LY M47K Source: http://www.osram.convergy.de LUXEON: - LUMILED® LXK2-PW12-R00, LXK2-PW12-S00, LXK2-PW14-U00, LXK2-PW14-V00 LXK2-PM12-R00, LXK2-PM12-S00, LXK2-PM14-U00 LXK2-PE12-Q00, LXK2-PE12-R00, LXK2-PE12-S00, LXK2-PE14-T00, LXK2-PE14-U00 LXK2-PB12-K00, LXK2-PB12-L00, LXK2-PB12-M00, LXK2-PB14-N00, LXK2-PB14-P00, LXK2-PB14-Q00 LXK2-PR12-L00, LXK2-PR12-M00, LXK2-PR14-Q00, LXK2-PR14-R00 LXK2-PD12-Q00, LXK2-PD12-R00, LXK2-PD12-S00 LXK2-PH12-R00, LXK2-PH12-S00 LXK2-PL12-P00, LXK2-PL12-Q00, LXK2-PL12-R00 Source: www.luxeon.com KINGBRIGHT: KA-3528ASYC Source: www.kingbright.com
POWER = con-shiua-chyuan:SCD-014A: Power Jack 2.5mm; OC_FARNELL: unknown; OC_NEWARK: unknown
POWER_1 POWER_2 SPEAKER_1 SPEAKER_2 VOUT_1-VOUT_3 = terminal_block:TERMINAL_BLOCK: Terminal Block
R1-R33 = rcl:R-EU_: RESISTOR, European symbol
SERIAL = pinhead:PINHD-1X12: PIN HEADER
T1 T2 = transistor:BD239: NPN TRANSISTOR Source: http://www.fairchildsemi.com/ds/BD/BD239C.pdf
TR2 TR4-TR7 = rcl:POTENTIOMETER_: Potentiometer
U$2 = potentiometer_stereo:POTI_STEREO: Stereo Potentiometer

## Net classes
0 default: width 0.406 mm, clearance 0.203 mm
1 lo_power: width 1.016 mm, clearance 0.305 mm
2 hi_pow: width 1.422 mm, clearance 0.406 mm